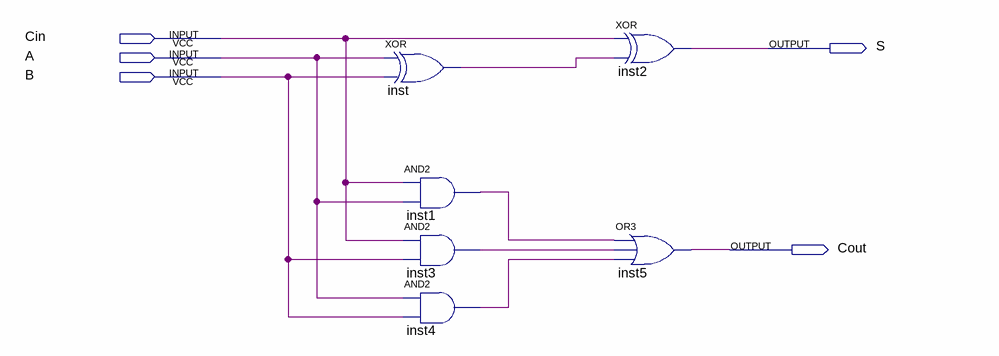
[diagram p0: schematic sheet]
// Quartus schematic FA.bdf as structural Verilog: 6 symbols, 5 pins
module FA (
  input  Cin,
  input  A,
  input  B,
  output S,
  output Cout
);

  wire inst1_out, inst3_out, inst4_out, inst_out;

  xor inst (inst_out, A, B);
  and inst1 (inst1_out, Cin, A);
  and inst3 (inst3_out, Cin, B);
  and inst4 (inst4_out, A, B);
  xor inst2 (S, Cin, inst_out);
  or inst5 (Cout, inst1_out, inst3_out, inst4_out);
endmodule
